# Altium schematic sheet rhd2132.SchDoc
size A4
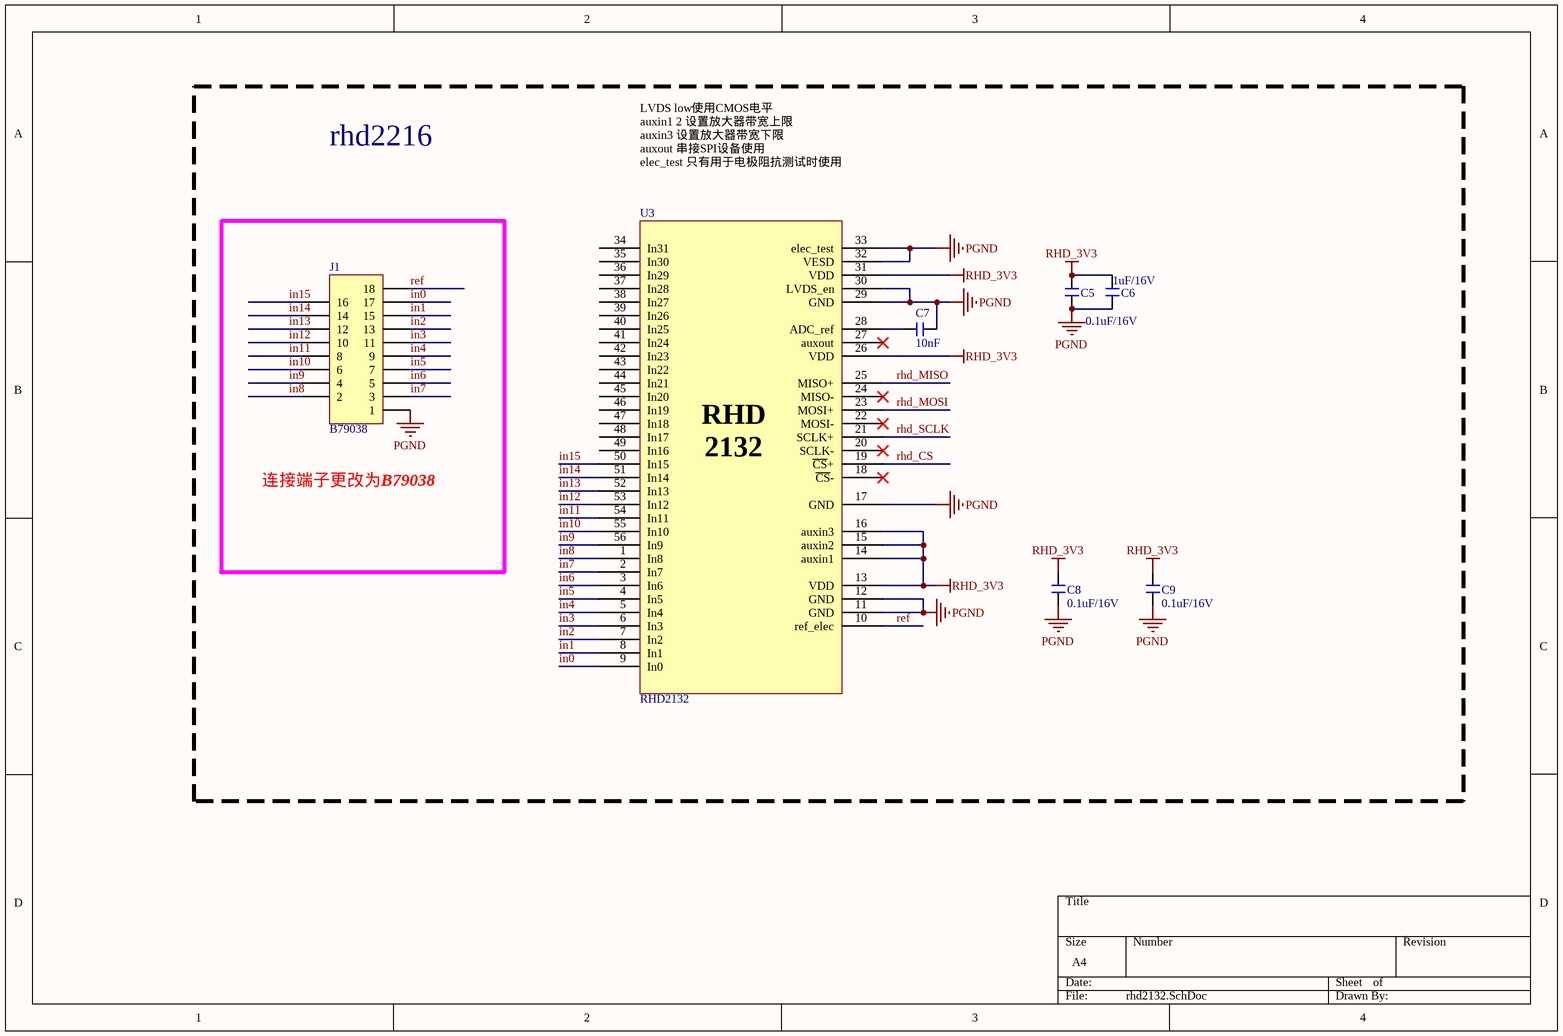
[diagram p0: rhd2132.SchDoc]

## Parts
C5  0.1uF/16V  [C 0201_L]
C6  1uF/16V  [C 0201_L]
C7  10nF  [C 0201_L]
C8  0.1uF/16V  [C 0201_L]
C9  0.1uF/16V  [C 0201_L]
J1  B79038  [B79038]
U3  RHD2132  [QFN-56-9mm]

## Blocks framed on the sheet
rhd2216: C5-C9 U3
连接端子更改为B79038: J1

## Nets
PGND: C5.1 C6.1 C7.2 C8.1 C9.1 J1.1 U3.11(GND) U3.12(GND) U3.17(GND) U3.29(GND) U3.30(LVDS_en) U3.32(VESD) U3.33(elec_test)
RHD_3V3: C5.2 C6.2 C8.2 C9.2 U3.13(VDD) U3.14(auxin1) U3.15(auxin2) U3.16(auxin3) U3.26(VDD) U3.31(VDD)
in0: J1.17 U3.9(In0)
in1: J1.15 U3.8(In1)
in2: J1.13 U3.7(In2)
in3: J1.11 U3.6(In3)
in4: J1.9 U3.5(In4)
in5: J1.7 U3.4(In5)
in6: J1.5 U3.3(In6)
in7: J1.3 U3.2(In7)
in8: J1.2 U3.1(In8)
in9: J1.4 U3.56(In9)
in10: J1.6 U3.55(In10)
in11: J1.8 U3.54(In11)
in12: J1.10 U3.53(In12)
in13: J1.12 U3.52(In13)
in14: J1.14 U3.51(In14)
in15: J1.16 U3.50(In15)
ref: J1.18 U3.10(ref_elec)
rhd_CS: U3.19(~{CS}+)
rhd_MISO: U3.25(MISO+)
rhd_MOSI: U3.23(MOSI+)
rhd_SCLK: U3.21(SCLK+)
NetC7_1: C7.1 U3.28(ADC_ref)

Not connected (* = marked no-connect by the designer): U3 18(~{CS}-)* 20(SCLK-)* 22(MOSI-)* 24(MISO-)* 27(auxout)* 34(In31) 35(In30) 36(In29) 37(In28) 38(In27) 39(In26) 40(In25) 41(In24) 42(In23) 43(In22) 44(In21) 45(In20) 46(In19) 47(In18) 48(In17) 49(In16)

## Notes on the sheet
- LVDS low使用CMOS电平
  auxin1 2 设置放大器带宽上限
  auxin3 设置放大器带宽下限
  auxout 串接SPI设备使用
  elec_test 只有用于电极阻抗测试时使用
  接地电极布于四周
- (in symbol RHD2132) RHD / 2132

## Library data of the parts
C5-C9 = C: 贴片电容; BOM名称: 无极性贴片电容
  C5 C8 C9: Value: 0.1uF/16V
  C6: Value: 1uF/16V
  C7: Value: 10nF
J1 = CON_A79015-001-18PIN: LatestRevisionDate: 17-Jul-2002; LatestRevisionNote: Re-released for DXP Platform.; Publisher: Altium Limited